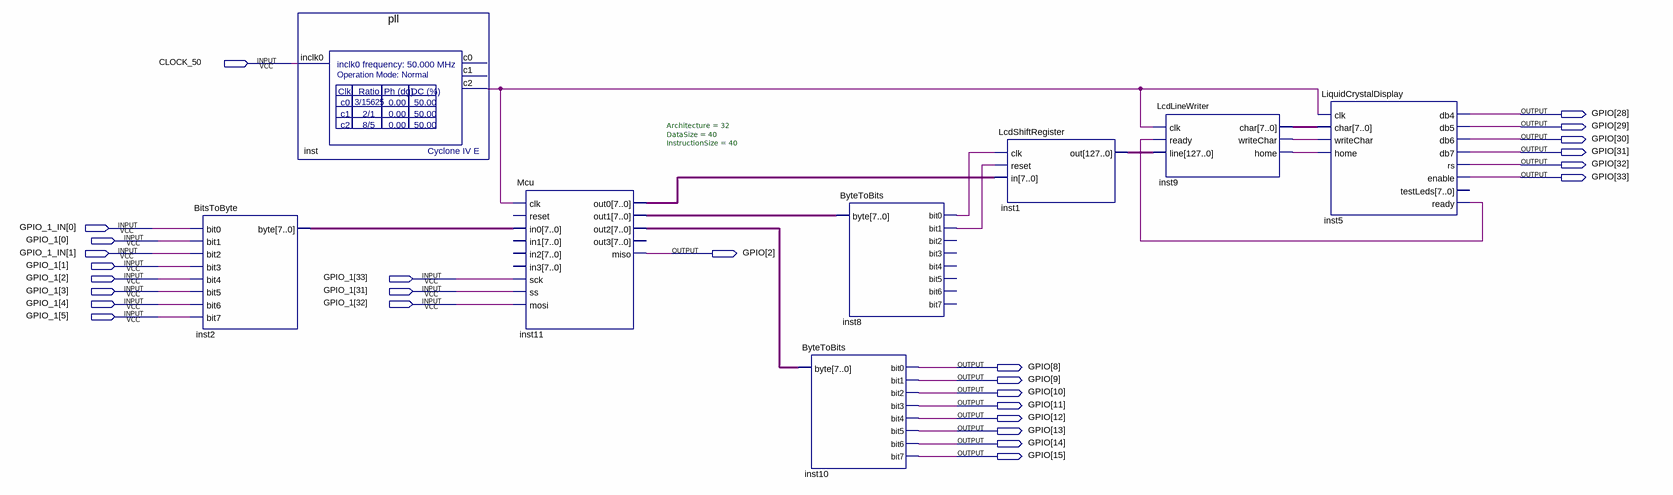
[diagram p0: schematic sheet]
// Quartus schematic BlueRacer.bdf as structural Verilog: 8 symbols, 27 pins
module BlueRacer (
  input  CLOCK_50,
  input  [1:0] GPIO_1_IN,
  input  [33:0] GPIO_1,
  output [33:2] GPIO
);

  wire inst5_ready, inst8_bit0, inst8_bit1, inst9_home, inst9_writechar, inst_c2;
  wire [7:0] inst2_byte, inst9_char, inst11_out0, inst11_out1, inst11_out2;
  wire [127:0] inst1_out;

  BitsToByte inst2 (
    .bit0(GPIO_1_IN[0]), .bit1(GPIO_1[0]), .bit2(GPIO_1_IN[1]), .bit3(GPIO_1[1]), .bit4(GPIO_1[2]),
    .bit5(GPIO_1[3]), .bit6(GPIO_1[4]), .bit7(GPIO_1[5]), .\byte (inst2_byte));
  pll inst (.inclk0(CLOCK_50), .c2(inst_c2));  // open: c0, c1
  Mcu #(.Architecture(32), .DataSize(40), .InstructionSize(40)) inst11 (
    .clk(inst_c2), .in0(inst2_byte), .sck(GPIO_1[33]), .ss(GPIO_1[31]), .mosi(GPIO_1[32]),
    .out0(inst11_out0), .out1(inst11_out1), .out2(inst11_out2), .miso(GPIO[2]));  // open: reset, in1, in2, in3, out3
  ByteToBits inst10 (
    .\byte (inst11_out2), .bit0(GPIO[8]), .bit1(GPIO[9]), .bit2(GPIO[10]), .bit3(GPIO[11]), .bit4(GPIO[12]),
    .bit5(GPIO[13]), .bit6(GPIO[14]), .bit7(GPIO[15]));
  ByteToBits inst8 (
    .\byte (inst11_out1), .bit0(inst8_bit0), .bit1(inst8_bit1));  // open: bit2, bit3, bit4, bit5, bit6, bit7
  LcdShiftRegister inst1 (.clk(inst8_bit0), .reset(inst8_bit1), .in(inst11_out0), .out(inst1_out));
  LcdLineWriter inst9 (
    .clk(inst_c2), .ready(inst5_ready), .line(inst1_out), .char(inst9_char), .writeChar(inst9_writechar),
    .home(inst9_home));
  LiquidCrystalDisplay inst5 (
    .clk(inst_c2), .char(inst9_char), .writeChar(inst9_writechar), .home(inst9_home), .db4(GPIO[28]),
    .db5(GPIO[29]), .db6(GPIO[30]), .db7(GPIO[31]), .rs(GPIO[32]), .enable(GPIO[33]), .ready(inst5_ready));  // open: testLeds
endmodule
